# Altium schematic sheet Sheet1.SchDoc
size A
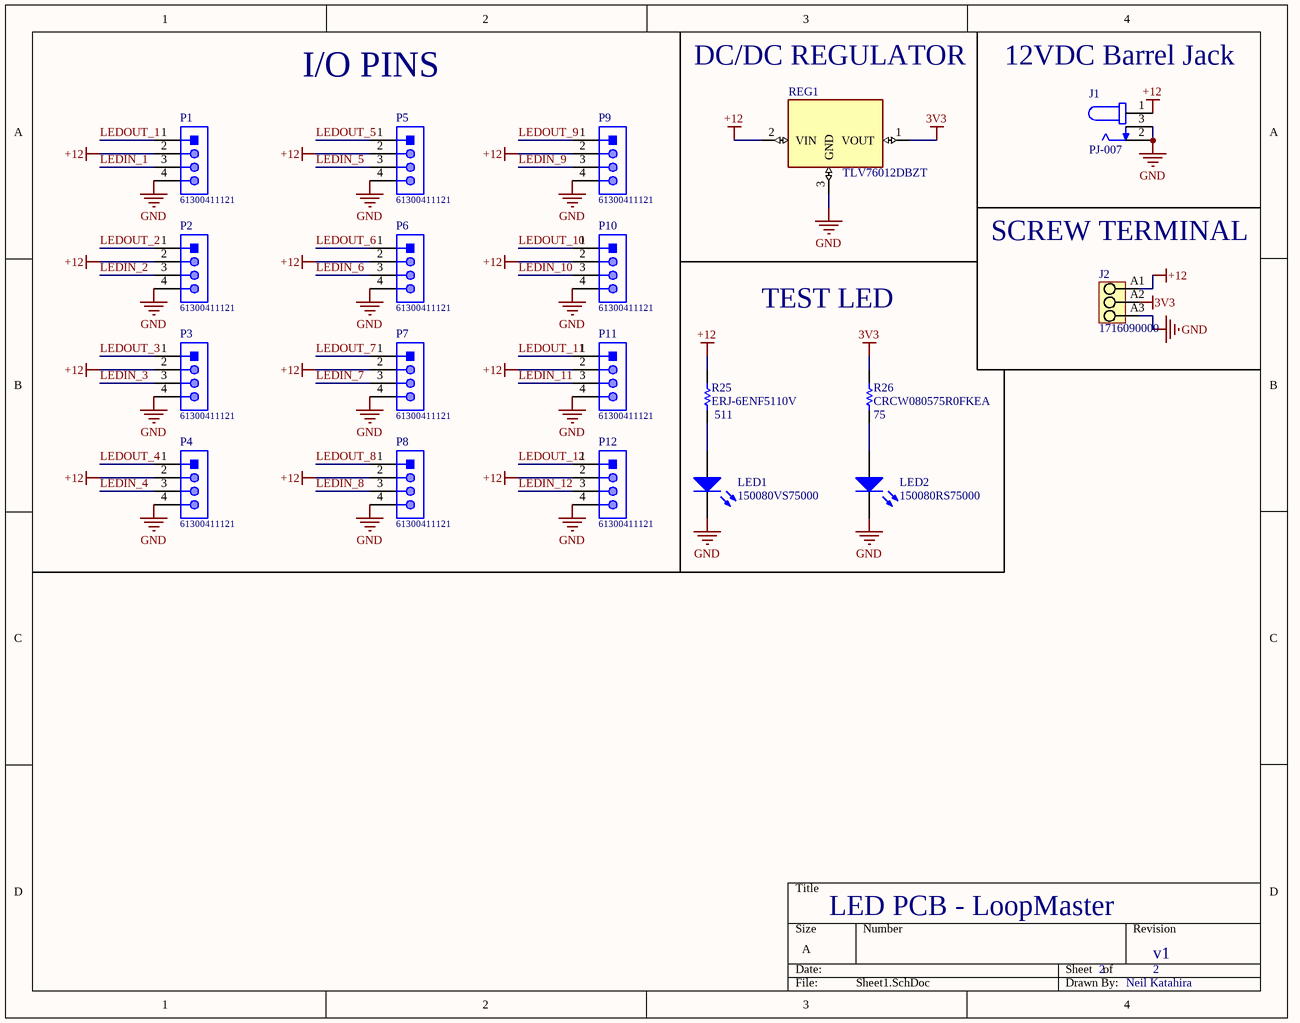
[diagram p0: Sheet1.SchDoc]

## Parts
J1  PJ-007  [CUI_PJ-007]
J2  1716090000  [LM_5_08_90_03]
LED1  150080VS75000  [0805_A]
LED2  150080RS75000  [0805_A]
P1  61300411121  [61300411121]
P2  61300411121  [61300411121]
P3  61300411121  [61300411121]
P4  61300411121  [61300411121]
P5  61300411121  [61300411121]
P6  61300411121  [61300411121]
P7  61300411121  [61300411121]
P8  61300411121  [61300411121]
P9  61300411121  [61300411121]
P10  61300411121  [61300411121]
P11  61300411121  [61300411121]
P12  61300411121  [61300411121]
R25  ERJ-6ENF5110V  [RESC2013X70X40ML20T20]
R26  CRCW080575R0FKEA  [RESC2013X50X30ML20T20]
REG1  TLV76012DBZT  [SOT23]

## Nets
3V3: J2.A2 R26.2 REG1.1(VOUT)
+12: J1.1 J2.A1 P1.2 P2.2 P3.2 P4.2 P5.2 P6.2 P7.2 P8.2 P9.2 P10.2 P11.2 P12.2 R25.2 REG1.2(VIN)
GND: J1.2 J1.3 J2.A3 LED1.1(K) LED2.1(K) P1.4 P2.4 P3.4 P4.4 P5.4 P6.4 P7.4 P8.4 P9.4 P10.4 P11.4 P12.4 REG1.3(GND)
LEDIN_1: P1.3
LEDIN_2: P2.3
LEDIN_3: P3.3
LEDIN_4: P4.3
LEDIN_5: P5.3
LEDIN_6: P6.3
LEDIN_7: P7.3
LEDIN_8: P8.3
LEDIN_9: P9.3
LEDIN_10: P10.3
LEDIN_11: P11.3
LEDIN_12: P12.3
LEDOUT_1: P1.1
LEDOUT_2: P2.1
LEDOUT_3: P3.1
LEDOUT_4: P4.1
LEDOUT_5: P5.1
LEDOUT_6: P6.1
LEDOUT_7: P7.1
LEDOUT_8: P8.1
LEDOUT_9: P9.1
LEDOUT_10: P10.1
LEDOUT_11: P11.1
LEDOUT_12: P12.1
NetLED1_2: LED1.2(A) R25.1
NetLED2_2: LED2.2(A) R26.1

## Notes on the sheet
- I/O PINS
- DC/DC REGULATOR
- (near J1) 12VDC Barrel Jack
- (near J2) SCREW TERMINAL
- TEST LED
- (near R25) 511
- (near R26) 75
- LED PCB - LoopMaster
- 2
- v1
- Neil Katahira

## Library data of the parts
J1 = PJ-007: 1.3 x 4.2 mm, 2.0 A, Horizontal, Through Hole, Dc Power Jack Connector; MF: CUI Devices; Availability: Unavailable; SnapEDA_Link: https://www.snapeda.com/parts/PJ-007/CUI%20Devices/view-part/260682/?ref=snap; MP: PJ-007; Price: None; Value: *; Package: None; CUI_purchase_URL: https://www.cuidevices.com/product/interconnect/connectors/dc-power-connectors/jacks/pj-007?utm_source=snapeda.com&utm_medium=referral&utm_campaign=snapedaBOM
J2 = CMP-1559-01768-1: OMNIMATE Signal - series LM; Manufacturer: Weidmueller; Contact_surface: tinned; Pitch_mm: 5,08 mm; Solder_pin_length_mm: 3,5 mm; Contact_material: Cu-Leg; Wire_cross_section_AWG_min_UL_1059: AWG 24; Solid_min_H05_07_V_U: 0,2 mm²; Insulating_material: Wemid (PA); Solid_max_H05_07_V_U: 2,5 mm²; Pitch_inch: 0,2 inch; Wire_cross_section_AWG_max_UL_1059: AWG 14; UL_94_flammability_rating: V-0; No_of_poles: 3; Rated_voltage_use_group_B_UL_1059: 300 V; Mounting_onto_the_PCB: Solder connection; Side_termination_characteristic: closed side; Short_text_for_material: LM 5.08/03/90 3.5SN OR BX; Rated_current_use_group_B_UL_1059: 15 A; Rated_voltage_for_surge_voltage_class_pollution_degree_II_2: 630 V; Revision: V1; ComponentLink2URL: http://catalog.weidmueller.com/catalog/Start.do?localeId=en&ObjectID=1716090000; Colour: Orange; PackageReference: LM_5_08_90_03; ComponentLink1Description: Manufacturer URL; ComponentLink2Description: URL Link1; ComponentLink1URL: http://www.weidmueller.com/; Qty: 500 PCS; PartNumber: 1716090000; Packaging: Box
LED1 = CMP-1426-00009-1: SMD mono-color Chip LED, WL-SMCW, Bright Green; Manufacturer: Wuerth Elektronik; ComponentLink1Description: Manufacturer URL; Color: Bright Green; PackageReference: 0805_A; PartNumber: 150080VS75000; ComponentLink1URL: http://www.we-online.com; ComponentLink2Description: Datasheet; ComponentLink2URL: http://katalog.we-online.com/led/datasheet/150080VS75000.pdf
LED2 = CMP-1426-00011-1: SMD mono-color Chip LED, WL-SMCW, Red; Manufacturer: Wuerth Elektronik; Color: Red; PartNumber: 150080RS75000; PackageReference: 0805_A; ComponentLink2Description: Datasheet; ComponentLink1URL: http://www.we-online.com; ComponentLink1Description: Manufacturer URL; ComponentLink2URL: http://katalog.we-online.com/led/datasheet/150080RS75000.pdf
P1-P12 = CMP-1502-01064-1: THT Vertical Pin Header WR-PHD, Pitch 2.54 mm, Single Row, 4 pins; Manufacturer: Wurth Elektronik; Withstanding Voltage: 500VAC; Rated Current: 3A; Working Voltage: 250VAC; Pin Number: 4; Gender: Male; Contact Resistance: 20mOhm; Pitch: 2.54mm; Manufacturer URL: http://www.we-online.de; Operating Temperature: -40to105degC; Packaging: Bag; Mounting Technology: THT; Package Reference: 61300411121; Datasheet URL: https://katalog.we-online.de/em/datasheet/6130xx11121.pdf; Publisher: WurthElektronik; Part Number: 61300411121; Row Number: Single; Orientation: Vertical
R25 = CMP-2001-00217-1: Manufacturer: Panasonic; Part Number: ERJ-6ENF5110V
R26 = CMP-2001-04108-1: Manufacturer: Vishay Dale; Part Number: CRCW080575R0FKEA
REG1 = TLV76012DBZT: Linear Voltage Regulator IC 1 Output 100mA SOT-23-3; MF: Texas Instruments; Availability: Unavailable; SnapEDA_Link: https://www.snapeda.com/parts/TLV76012DBZT/Texas%20Instruments/view-part/2782786/?ref=snap; MP: TLV76012DBZT; Price: None; Package: SOT-23-3 Texas Instruments; Value: *